# Altium schematic sheet ultrasonic_tx.SchDoc: Opo
size Letter; Author: William Huang; Engineer: William Huang; Revision: 3.0
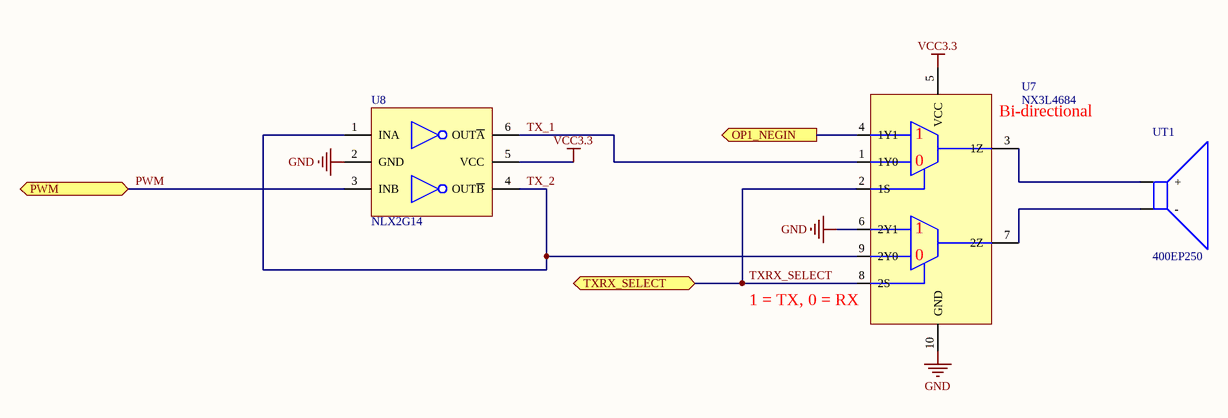
[diagram p0: ultrasonic_tx.SchDoc]

## Parts
U7  NX3L4684  [QFN50P155X200X13-10N]
U8  NLX2G14  [ULLGA6]
UT1  400EP250  [Transducer recepticle]

## Ports
OP1_NEGIN (out), PWM, TXRX_SELECT

## Nets
GND: U7.6(2Y1) U7.10(GND) U8.2(GND)
VCC3.3: U7.5(VCC) U8.5(VCC)
OP1_NEGIN: U7.4(1Y1) ; port OP1_NEGIN
PWM: U8.3(INB) ; port PWM
TX_1: U7.1(1Y0) U8.6(OUT~{A})
TX_2: U7.9(2Y0) U8.1(INA) U8.4(OUT~{B})
TXRX_SELECT: U7.2(1S) U7.8(2S) ; port TXRX_SELECT
NetU7_3: U7.3(1Z) UT1.2(+)
NetU7_7: U7.7(2Z) UT1.1(-)

## Notes on the sheet
- (near U7) Bi-directional
- (near U7) 1 = TX, 0 = RX
- Title
- Date:
- Author:
- Revision:
- Sheet
- of
- University of Michigan
- File:
- (in symbol NX3L4684) 0

## Library data of the parts
U7 = NX3L4684: IC ANALOG SWITCH SPDT 10XQFN; Supplier 1: Digi-Key; Supplier Part Number 1: 568-5564-1-ND
U8 = NLX2G14: IC INVERTER DUAL SCHMTRIG ULLGA6; Supplier 1: Digi-Key; Supplier Part Number 1: NLX2G14AMX1TCGOSCT-ND
UT1 = Tranducer: Air Ultrasounic Ceramic Transducers; Supplier 1: Digi-Key; Supplier Part Number 1: ED90088-ND